# Altium schematic sheet NAVIGATION - MCU.SchDoc
size A2; SheetNumber: 6; SheetTotal: 7
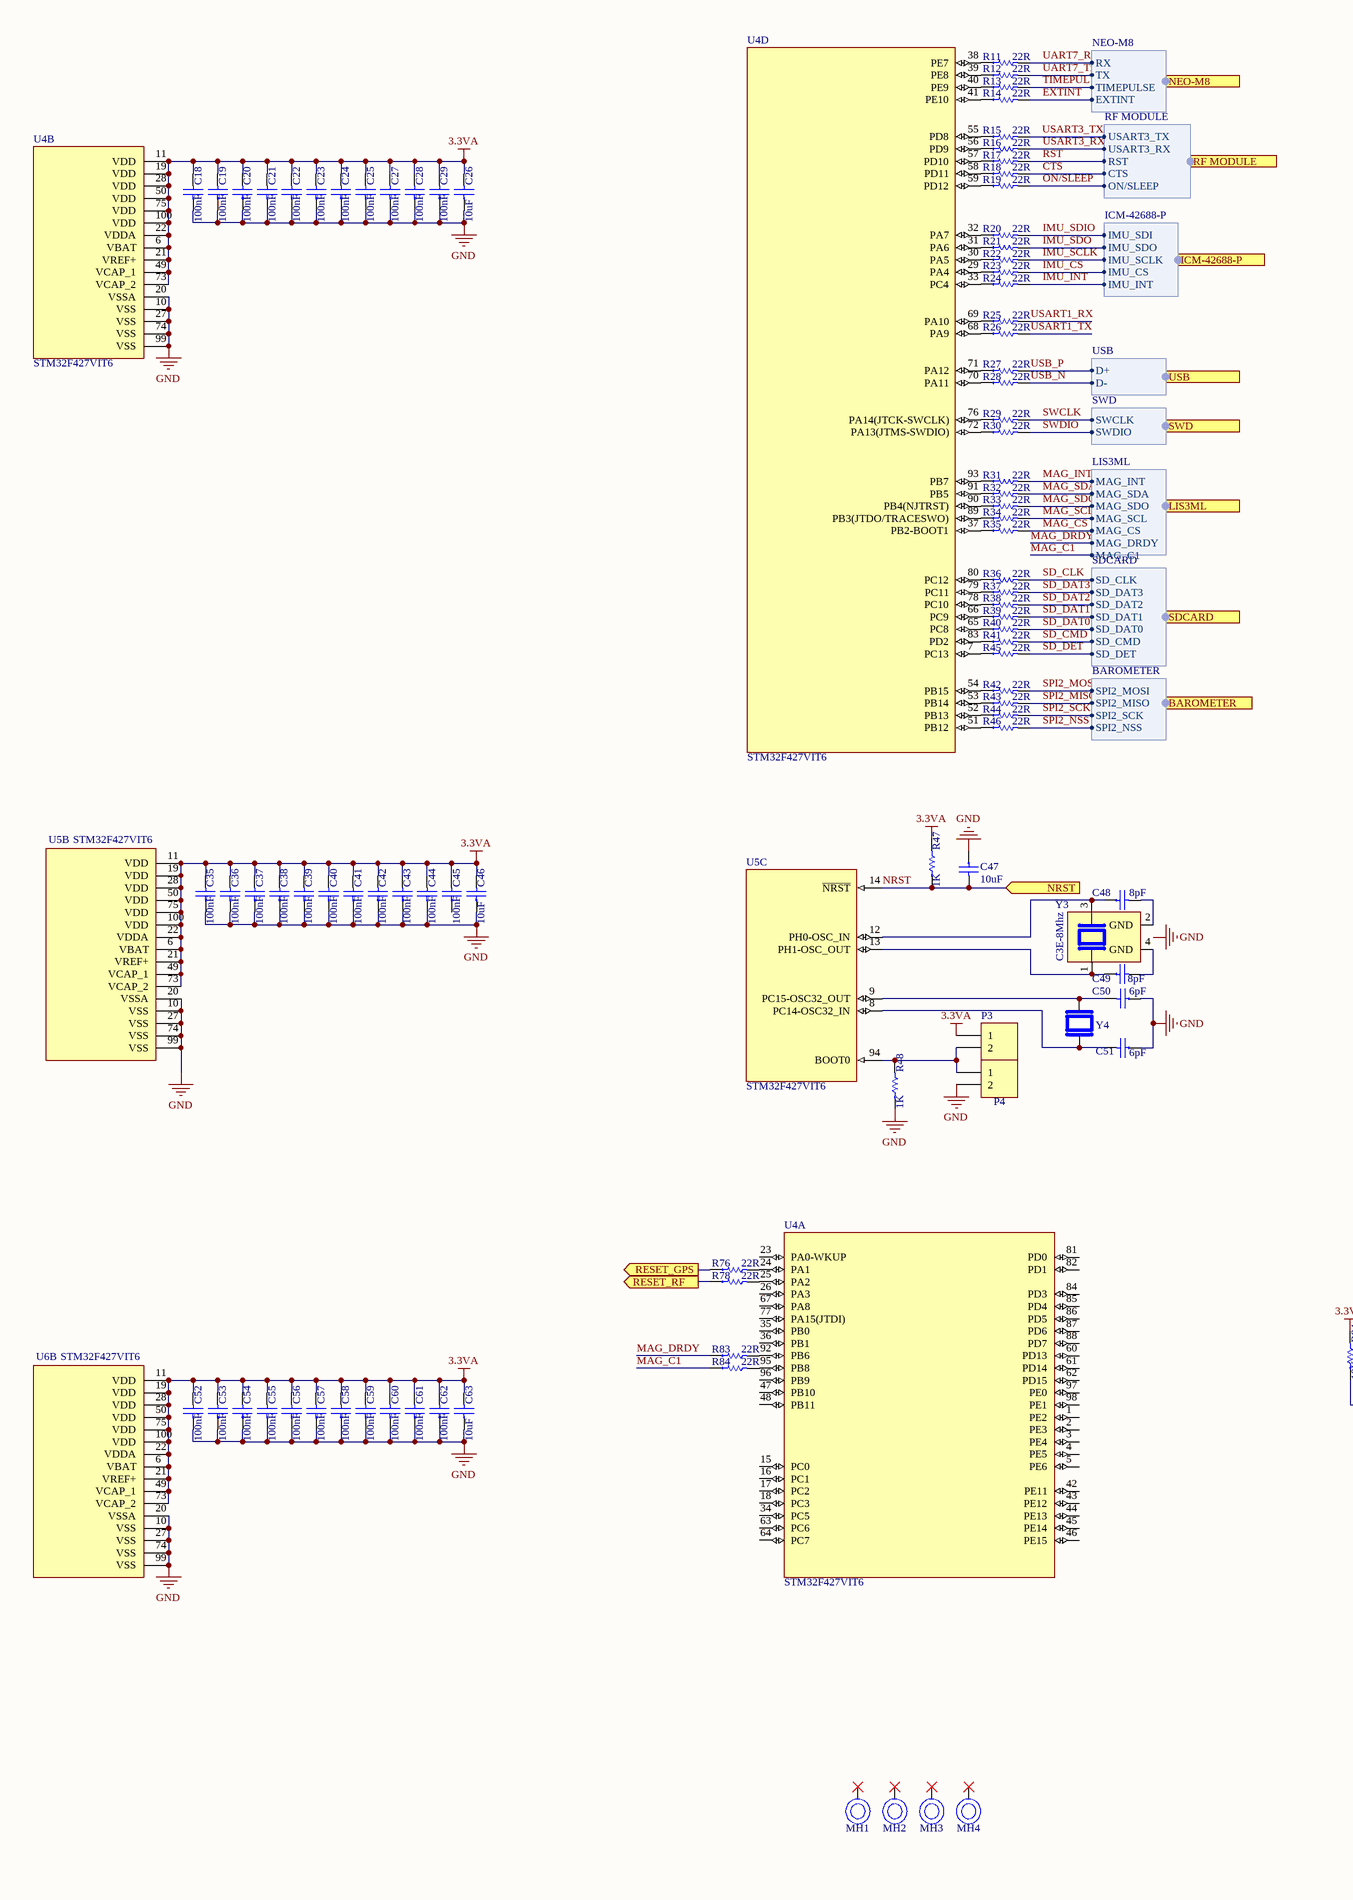
[diagram p0: NAVIGATION - MCU.SchDoc, left]
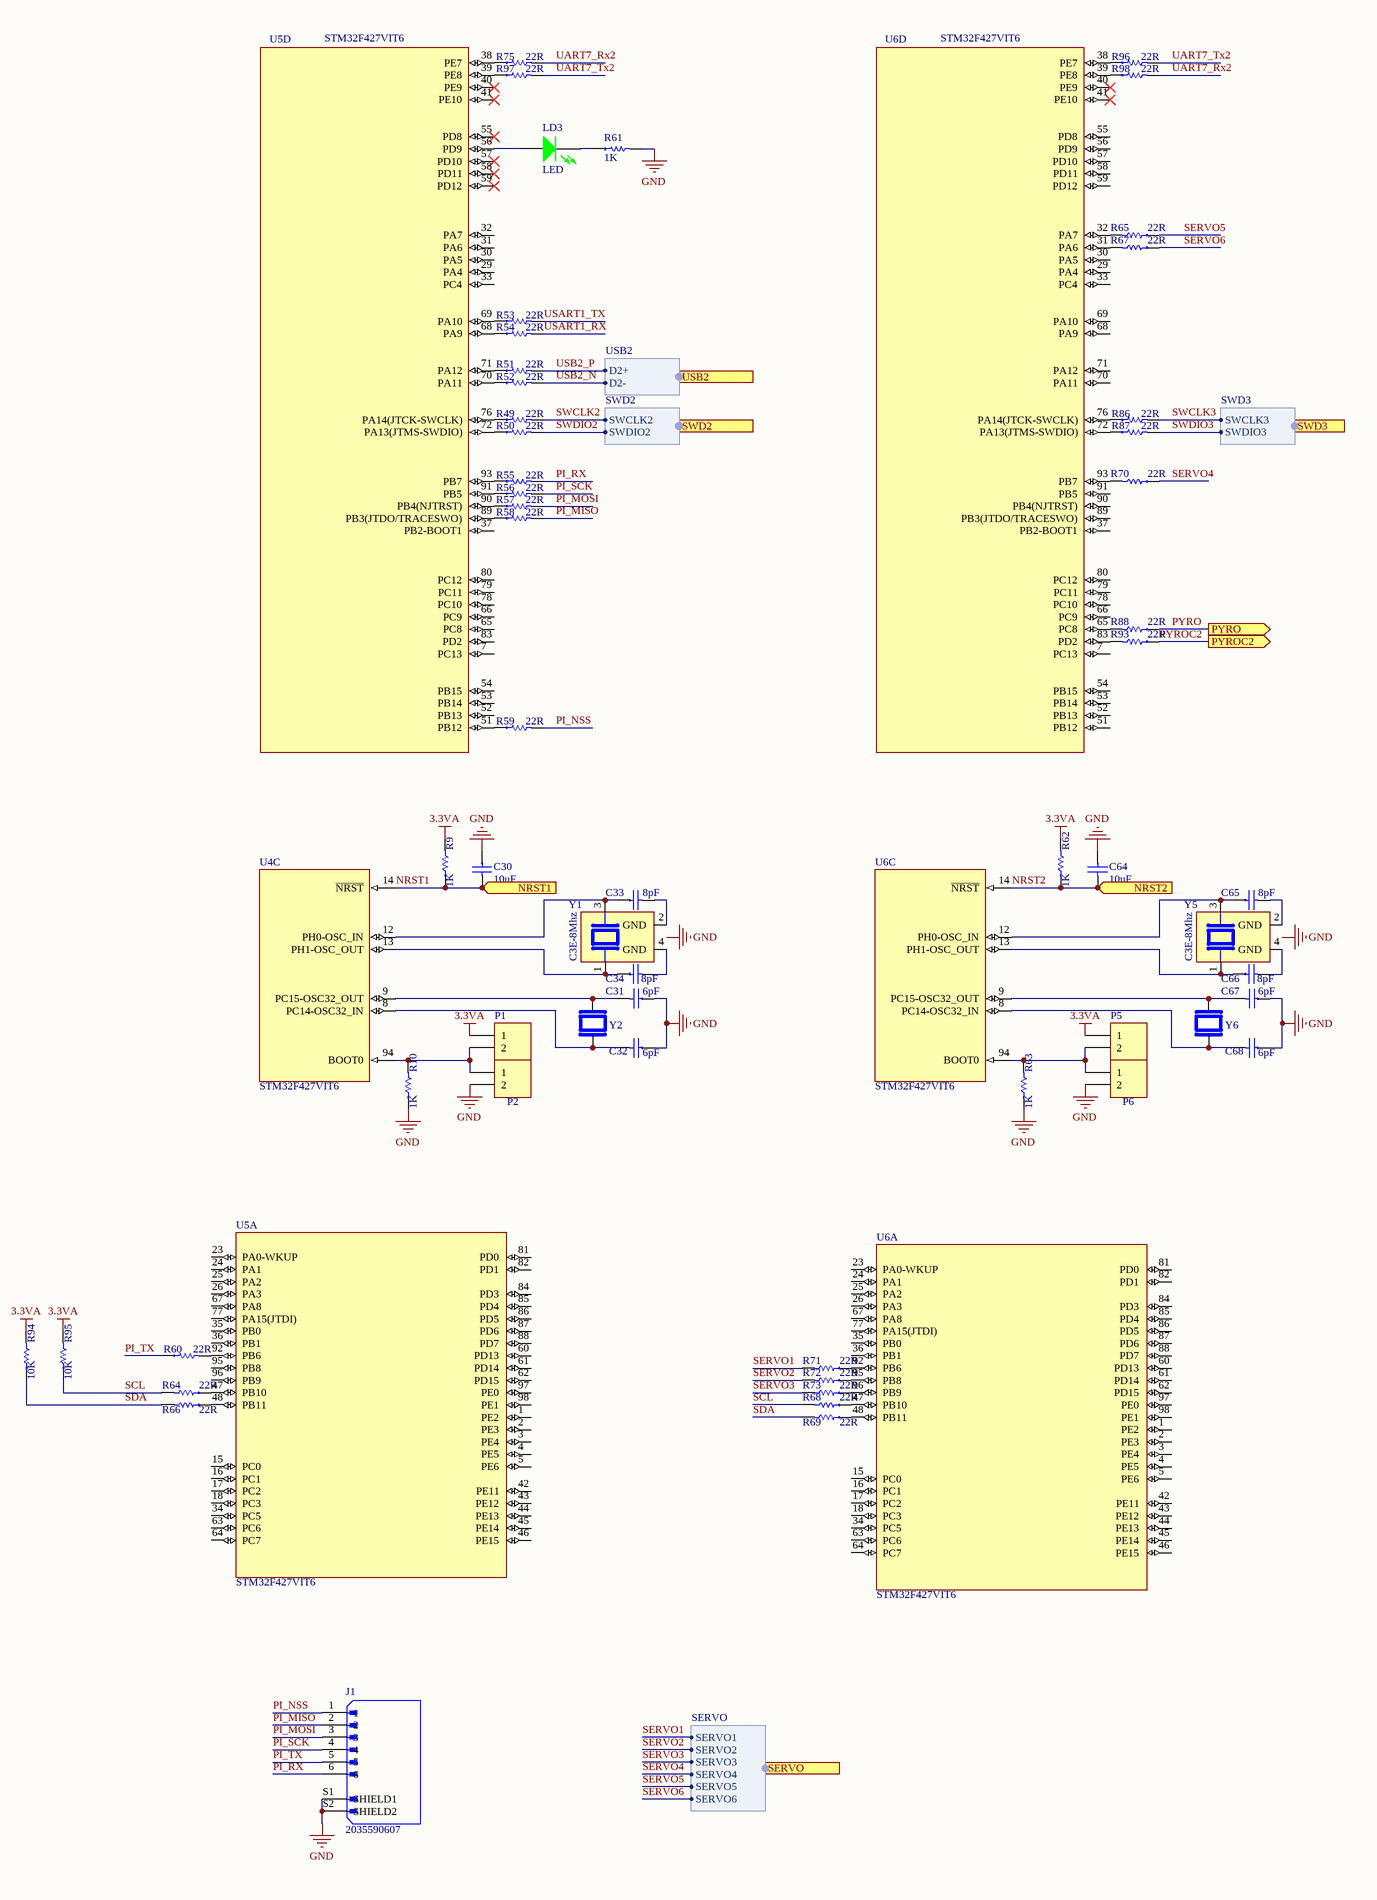
[diagram p1: NAVIGATION - MCU.SchDoc, right]

## Parts
C18  100nF  [CAP-CER0402-0.5H]
C19  100nF  [CAP-CER0402-0.5H]
C20  100nF  [CAP-CER0402-0.5H]
C21  100nF  [CAP-CER0402-0.5H]
C22  100nF  [CAP-CER0402-0.5H]
C23  100nF  [CAP-CER0402-0.5H]
C24  100nF  [CAP-CER0402-0.5H]
C25  100nF  [CAP-CER0402-0.5H]
C26  10uF  [CAP-CER0402-20mil]
C27  100nF  [CAP-CER0402-0.5H]
C28  100nF  [CAP-CER0402-0.5H]
C29  100nF  [CAP-CER0402-0.5H]
C30  10uF  [CAP-CER0402-20mil]
C31  6pF  [CAP-CER0402-0.5H]
C32  6pF  [CAP-CER0402-0.5H]
C33  8pF  [CAP-CER0402-0.5H]
C34  8pF  [CAP-CER0402-0.5H]
C35  100nF  [CAP-CER0402-0.5H]
C36  100nF  [CAP-CER0402-0.5H]
C37  100nF  [CAP-CER0402-0.5H]
C38  100nF  [CAP-CER0402-0.5H]
C39  100nF  [CAP-CER0402-0.5H]
C40  100nF  [CAP-CER0402-0.5H]
C41  100nF  [CAP-CER0402-0.5H]
C42  100nF  [CAP-CER0402-0.5H]
C43  100nF  [CAP-CER0402-0.5H]
C44  100nF  [CAP-CER0402-0.5H]
C45  100nF  [CAP-CER0402-0.5H]
C46  10uF  [CAP-CER0402-20mil]
C47  10uF  [CAP-CER0402-20mil]
C48  8pF  [CAP-CER0402-0.5H]
C49  8pF  [CAP-CER0402-0.5H]
C50  6pF  [CAP-CER0402-0.5H]
C51  6pF  [CAP-CER0402-0.5H]
C52  100nF  [CAP-CER0402-0.5H]
C53  100nF  [CAP-CER0402-0.5H]
C54  100nF  [CAP-CER0402-0.5H]
C55  100nF  [CAP-CER0402-0.5H]
C56  100nF  [CAP-CER0402-0.5H]
C57  100nF  [CAP-CER0402-0.5H]
C58  100nF  [CAP-CER0402-0.5H]
C59  100nF  [CAP-CER0402-0.5H]
C60  100nF  [CAP-CER0402-0.5H]
C61  100nF  [CAP-CER0402-0.5H]
C62  100nF  [CAP-CER0402-0.5H]
C63  10uF  [CAP-CER0402-20mil]
C64  10uF  [CAP-CER0402-20mil]
C65  8pF  [CAP-CER0402-0.5H]
C66  8pF  [CAP-CER0402-0.5H]
C67  6pF  [CAP-CER0402-0.5H]
C68  6pF  [CAP-CER0402-0.5H]
J1  2035590607  [MOLEX_2035590607]
LD3  LED  [LED-IND0402-GRE-0.4H]
MH1  MOUNTING HOLE  [M3]  (value not drawn)
MH2  MOUNTING HOLE  [M3]  (value not drawn)
MH3  MOUNTING HOLE  [M3]  (value not drawn)
MH4  MOUNTING HOLE  [M3]  (value not drawn)
P1  Header 2  [HDR1X2]  (value not drawn)
P2  Header 2  [HDR1X2]  (value not drawn)
P3  Header 2  [HDR1X2]  (value not drawn)
P4  Header 2  [HDR1X2]  (value not drawn)
P5  Header 2  [HDR1X2]  (value not drawn)
P6  Header 2  [HDR1X2]  (value not drawn)
R9  1K  [RES-CHP0402-0.35H]
R10  1K  [RES-CHP0402-0.35H]
R11  22R  [RES-CHP0402-0.35H]
R12  22R  [RES-CHP0402-0.35H]
R13  22R  [RES-CHP0402-0.35H]
R14  22R  [RES-CHP0402-0.35H]
R15  22R  [RES-CHP0402-0.35H]
R16  22R  [RES-CHP0402-0.35H]
R17  22R  [RES-CHP0402-0.35H]
R18  22R  [RES-CHP0402-0.35H]
R19  22R  [RES-CHP0402-0.35H]
R20  22R  [RES-CHP0402-0.35H]
R21  22R  [RES-CHP0402-0.35H]
R22  22R  [RES-CHP0402-0.35H]
R23  22R  [RES-CHP0402-0.35H]
R24  22R  [RES-CHP0402-0.35H]
R25  22R  [RES-CHP0402-0.35H]
R26  22R  [RES-CHP0402-0.35H]
R27  22R  [RES-CHP0402-0.35H]
R28  22R  [RES-CHP0402-0.35H]
R29  22R  [RES-CHP0402-0.35H]
R30  22R  [RES-CHP0402-0.35H]
R31  22R  [RES-CHP0402-0.35H]
R32  22R  [RES-CHP0402-0.35H]
R33  22R  [RES-CHP0402-0.35H]
R34  22R  [RES-CHP0402-0.35H]
R35  22R  [RES-CHP0402-0.35H]
R36  22R  [RES-CHP0402-0.35H]
R37  22R  [RES-CHP0402-0.35H]
R38  22R  [RES-CHP0402-0.35H]
R39  22R  [RES-CHP0402-0.35H]
R40  22R  [RES-CHP0402-0.35H]
R41  22R  [RES-CHP0402-0.35H]
R42  22R  [RES-CHP0402-0.35H]
R43  22R  [RES-CHP0402-0.35H]
R44  22R  [RES-CHP0402-0.35H]
R45  22R  [RES-CHP0402-0.35H]
R46  22R  [RES-CHP0402-0.35H]
R47  1K  [RES-CHP0402-0.35H]
R48  1K  [RES-CHP0402-0.35H]
R49  22R  [RES-CHP0402-0.35H]
R50  22R  [RES-CHP0402-0.35H]
R51  22R  [RES-CHP0402-0.35H]
R52  22R  [RES-CHP0402-0.35H]
R53  22R  [RES-CHP0402-0.35H]
R54  22R  [RES-CHP0402-0.35H]
R55  22R  [RES-CHP0402-0.35H]
R56  22R  [RES-CHP0402-0.35H]
R57  22R  [RES-CHP0402-0.35H]
R58  22R  [RES-CHP0402-0.35H]
R59  22R  [RES-CHP0402-0.35H]
R60  22R  [RES-CHP0402-0.35H]
R61  1K  [RES-CHP0402-0.35H]
R62  1K  [RES-CHP0402-0.35H]
R63  1K  [RES-CHP0402-0.35H]
R64  22R  [RES-CHP0402-0.35H]
R65  22R  [RES-CHP0402-0.35H]
R66  22R  [RES-CHP0402-0.35H]
R67  22R  [RES-CHP0402-0.35H]
R68  22R  [RES-CHP0402-0.35H]
R69  22R  [RES-CHP0402-0.35H]
R70  22R  [RES-CHP0402-0.35H]
R71  22R  [RES-CHP0402-0.35H]
R72  22R  [RES-CHP0402-0.35H]
R73  22R  [RES-CHP0402-0.35H]
R75  22R  [RES-CHP0402-0.35H]
R76  22R  [RES-CHP0402-0.35H]
R78  22R  [RES-CHP0402-0.35H]
R83  22R  [RES-CHP0402-0.35H]
R84  22R  [RES-CHP0402-0.35H]
R86  22R  [RES-CHP0402-0.35H]
R87  22R  [RES-CHP0402-0.35H]
R88  22R  [RES-CHP0402-0.35H]
R93  22R  [RES-CHP0402-0.35H]
R94  10K  [RES-CHP0402-0.35H]
R95  10K  [RES-CHP0402-0.35H]
R96  22R  [RES-CHP0402-0.35H]
R97  22R  [RES-CHP0402-0.35H]
R98  22R  [RES-CHP0402-0.35H]
U4  STM32F427VIT6  [QFP50P1600X1600X160-100N]  (parts A,B,C,D of 4)
U5  STM32F427VIT6  [QFP50P1600X1600X160-100N]  (parts A,B,C,D of 4)
U6  STM32F427VIT6  [QFP50P1600X1600X160-100N]  (parts A,B,C,D of 4)
Y1  C3E-8Mhz  [XTAL_C3E-8.000-8-1015-R]
Y2  ABS07-120-32.768KHZ-T  [XTAL_ABS07-120-32.768KHZ-T]  (value not drawn)
Y3  C3E-8Mhz  [XTAL_C3E-8.000-8-1015-R]
Y4  ABS07-120-32.768KHZ-T  [XTAL_ABS07-120-32.768KHZ-T]  (value not drawn)
Y5  C3E-8Mhz  [XTAL_C3E-8.000-8-1015-R]
Y6  ABS07-120-32.768KHZ-T  [XTAL_ABS07-120-32.768KHZ-T]  (value not drawn)

## Ports
BAROMETER (harness BAROMETER), ICM-42688-P (harness ICM-42688-P), LIS3ML (harness LIS3ML), NEO-M8 (harness NEO-M8), NRST1 (in), NRST2 (in), NRST (in), PYRO (out), PYROC2 (out), RESET_GPS (out), RESET_RF (out), RF MODULE (harness RF MODULE), SDCARD (harness SDCARD), SERVO (harness SERVO), SWD2 (harness SWD2), SWD3 (harness SWD3), SWD (harness SWD), USB2 (harness USB2), USB (harness USB)

## Harnesses
NEO-M8: RX, TX, TIMEPULSE, EXTINT
RF MODULE: USART3_TX, USART3_RX, RST, CTS, ON/SLEEP
ICM-42688-P: IMU_SDI, IMU_SDO, IMU_SCLK, IMU_CS, IMU_INT
USB: D-, D+
BAROMETER: SPI2_MOSI, SPI2_MISO, SPI2_SCK, SPI2_NSS
SDCARD: SD_CLK, SD_DAT3, SD_DAT2, SD_DAT1, SD_DAT0, SD_CMD, SD_DET
LIS3ML: MAG_INT, MAG_SDA, MAG_SDO, MAG_SCL, MAG_CS, MAG_DRDY, MAG_C1
SWD: SWDIO, SWCLK
USB2: D2-, D2+
SERVO: SERVO1, SERVO2, SERVO3, SERVO4, SERVO5, SERVO6
SWD2: SWDIO2, SWCLK2
SWD3: SWDIO3, SWCLK3

## Nets
3.3VA: C18.2 C19.2 C20.2 C21.2 C22.2 C23.2 C24.2 C25.2 C26.2 C27.2 C28.2 C29.2 C35.2 C36.2 C37.2 C38.2 C39.2 C40.2 C41.2 C42.2 C43.2 C44.2 C45.2 C46.2 C52.2 C53.2 C54.2 C55.2 C56.2 C57.2 C58.2 C59.2 C60.2 C61.2 C62.2 C63.2 P1.1 P3.1 P5.1 R9.2 R47.2 R62.2 R94.2 R95.2 U4.6(VBAT) U4.11(VDD) U4.19(VDD) U4.21(VREF+) U4.22(VDDA) U4.28(VDD) U4.49(VCAP_1) U4.50(VDD) U4.73(VCAP_2) U4.75(VDD) U4.100(VDD) U5.6(VBAT) U5.11(VDD) U5.19(VDD) U5.21(VREF+) U5.22(VDDA) U5.28(VDD) U5.49(VCAP_1) U5.50(VDD) U5.73(VCAP_2) U5.75(VDD) U5.100(VDD) U6.6(VBAT) U6.11(VDD) U6.19(VDD) U6.21(VREF+) U6.22(VDDA) U6.28(VDD) U6.49(VCAP_1) U6.50(VDD) U6.73(VCAP_2) U6.75(VDD) U6.100(VDD)
GND: C18.1 C19.1 C20.1 C21.1 C22.1 C23.1 C24.1 C25.1 C26.1 C27.1 C28.1 C29.1 C30.1 C31.1 C32.1 C35.1 C36.1 C37.1 C38.1 C39.1 C40.1 C41.1 C42.1 C43.1 C44.1 C46.1 C47.1 C50.1 C51.1 C52.1 C53.1 C54.1 C55.1 C56.1 C57.1 C58.1 C59.1 C60.1 C61.1 C62.1 C63.1 C64.1 C67.1 C68.1 J1.S1(SHIELD1) J1.S2(SHIELD2) P2.2 P4.2 P6.2 R10.1 R48.1 R61.2 R63.1 U4.10(VSS) U4.20(VSSA) U4.27(VSS) U4.74(VSS) U4.99(VSS) U5.10(VSS) U5.20(VSSA) U5.27(VSS) U5.74(VSS) U5.99(VSS) U6.10(VSS) U6.20(VSSA) U6.27(VSS) U6.74(VSS) U6.99(VSS)
CTS: R18.2 ; port RF MODULE.CTS
EXTINT: R14.2 ; port NEO-M8.EXTINT
IMU_CS: R23.2 ; port ICM-42688-P.IMU_CS
IMU_INT: R24.2 ; port ICM-42688-P.IMU_INT
IMU_SCLK: R22.2 ; port ICM-42688-P.IMU_SCLK
IMU_SDIO: R20.2 ; port ICM-42688-P.IMU_SDI
IMU_SDO: R21.2 ; port ICM-42688-P.IMU_SDO
MAG_C1: R84.1 ; port LIS3ML.MAG_C1
MAG_CS: R35.2 ; port LIS3ML.MAG_CS
MAG_DRDY: R83.1 ; port LIS3ML.MAG_DRDY
MAG_INT: R31.2 ; port LIS3ML.MAG_INT
MAG_SCL: R34.2 ; port LIS3ML.MAG_SCL
MAG_SDA: R32.2 ; port LIS3ML.MAG_SDA
MAG_SDO: R33.2 ; port LIS3ML.MAG_SDO
NRST: C47.2 R47.1 U5.14(~{NRST}) ; port NRST
NRST1: C30.2 R9.1 U4.14(~{NRST}) ; port NRST1
NRST2: C64.2 R62.1 U6.14(~{NRST}) ; port NRST2
ON/SLEEP: R19.2 ; port RF MODULE.ON/SLEEP
PI_MISO: J1.2 R58.2
PI_MOSI: J1.3 R57.2
PI_NSS: J1.1 R59.2
PI_RX: J1.6 R55.2
PI_SCK: J1.4 R56.2
PI_TX: J1.5 R60.1
PYRO: R88.1 ; port PYRO
PYROC2: R93.1 ; port PYROC2
RESET_GPS: R76.1 ; port RESET_GPS
RESET_RF: R78.1 ; port RESET_RF
RST: R17.2 ; port RF MODULE.RST
SCL: R64.2 R68.2 R95.1
SD_CLK: R36.2 ; port SDCARD.SD_CLK
SD_CMD: R41.2 ; port SDCARD.SD_CMD
SD_DAT0: R40.2 ; port SDCARD.SD_DAT0
SD_DAT1: R39.2 ; port SDCARD.SD_DAT1
SD_DAT2: R38.2 ; port SDCARD.SD_DAT2
SD_DAT3: R37.2 ; port SDCARD.SD_DAT3
SD_DET: R45.2 ; port SDCARD.SD_DET
SDA: R66.2 R69.2 R94.1
SERVO1: R71.2 ; port SERVO.SERVO1
SERVO2: R72.2 ; port SERVO.SERVO2
SERVO3: R73.2 ; port SERVO.SERVO3
SERVO4: R70.1 ; port SERVO.SERVO4
SERVO5: R65.1 ; port SERVO.SERVO5
SERVO6: R67.1 ; port SERVO.SERVO6
SPI2_MISO: R43.2 ; port BAROMETER.SPI2_MISO
SPI2_MOSI: R42.2 ; port BAROMETER.SPI2_MOSI
SPI2_NSS: R46.2 ; port BAROMETER.SPI2_NSS
SPI2_SCK: R44.2 ; port BAROMETER.SPI2_SCK
SWCLK: R29.2 ; port SWD.SWCLK
SWCLK2: R49.2 ; port SWD2.SWCLK2
SWCLK3: R86.2 ; port SWD3.SWCLK3
SWDIO: R30.2 ; port SWD.SWDIO
SWDIO2: R50.2 ; port SWD2.SWDIO2
SWDIO3: R87.2 ; port SWD3.SWDIO3
TIMEPUL: R13.2 ; port NEO-M8.TIMEPULSE
UART7_Rx: R11.2 ; port NEO-M8.RX
UART7_Rx2: R75.2 R98.2
UART7_Tx: R12.2 ; port NEO-M8.TX
UART7_Tx2: R96.2 R97.2
USART1_RX: R25.2 R54.2
USART1_TX: R26.2 R53.2
USART3_RX: R16.2 ; port RF MODULE.USART3_RX
USART3_TX: R15.2 ; port RF MODULE.USART3_TX
USB2_N: R52.2 ; port USB2.D2-
USB2_P: R51.2 ; port USB2.D2+
USB_N: R28.2 ; port USB.D-
USB_P: R27.2 ; port USB.D+
NetC31_2: C31.2 U4.9(PC15-OSC32_OUT) Y2.2
NetC32_2: C32.2 U4.8(PC14-OSC32_IN) Y2.1
NetC33_1: C33.1 U4.12(PH0-OSC_IN) Y1.3
NetC33_2: C33.2 Y1.2(GND)
NetC34_1: C34.1 U4.13(PH1-OSC_OUT) Y1.1
NetC34_2: C34.2 Y1.4(GND)
NetC48_1: C48.1 U5.12(PH0-OSC_IN) Y3.3
NetC48_2: C48.2 Y3.2(GND)
NetC49_1: C49.1 U5.13(PH1-OSC_OUT) Y3.1
NetC49_2: C49.2 Y3.4(GND)
NetC50_2: C50.2 U5.9(PC15-OSC32_OUT) Y4.2
NetC51_2: C51.2 U5.8(PC14-OSC32_IN) Y4.1
NetC65_1: C65.1 U6.12(PH0-OSC_IN) Y5.3
NetC65_2: C65.2 Y5.2(GND)
NetC66_1: C66.1 U6.13(PH1-OSC_OUT) Y5.1
NetC66_2: C66.2 Y5.4(GND)
NetC67_2: C67.2 U6.9(PC15-OSC32_OUT) Y6.2
NetC68_2: C68.2 U6.8(PC14-OSC32_IN) Y6.1
NetLD3_1: LD3.1(A) U5.56(PD9)
NetLD3_2: LD3.2(K) R61.1
NetP1_2: P1.2 P2.1 R10.2 U4.94(BOOT0)
NetP3_2: P3.2 P4.1 R48.2 U5.94(BOOT0)
NetP5_2: P5.2 P6.1 R63.2 U6.94(BOOT0)
NetR11_1: R11.1 U4.38(PE7)
NetR12_1: R12.1 U4.39(PE8)
NetR13_1: R13.1 U4.40(PE9)
NetR14_1: R14.1 U4.41(PE10)
NetR15_1: R15.1 U4.55(PD8)
NetR16_1: R16.1 U4.56(PD9)
NetR17_1: R17.1 U4.57(PD10)
NetR18_1: R18.1 U4.58(PD11)
NetR19_1: R19.1 U4.59(PD12)
NetR20_1: R20.1 U4.32(PA7)
NetR21_1: R21.1 U4.31(PA6)
NetR22_1: R22.1 U4.30(PA5)
NetR23_1: R23.1 U4.29(PA4)
NetR24_1: R24.1 U4.33(PC4)
NetR25_1: R25.1 U4.69(PA10)
NetR26_1: R26.1 U4.68(PA9)
NetR27_1: R27.1 U4.71(PA12)
NetR28_1: R28.1 U4.70(PA11)
NetR29_1: R29.1 U4.76(PA14(JTCK-SWCLK))
NetR30_1: R30.1 U4.72(PA13(JTMS-SWDIO))
NetR31_1: R31.1 U4.93(PB7)
NetR32_1: R32.1 U4.91(PB5)
NetR33_1: R33.1 U4.90(PB4(NJTRST))
NetR34_1: R34.1 U4.89(PB3(JTDO/TRACESWO))
NetR35_1: R35.1 U4.37(PB2-BOOT1)
NetR36_1: R36.1 U4.80(PC12)
NetR37_1: R37.1 U4.79(PC11)
NetR38_1: R38.1 U4.78(PC10)
NetR39_1: R39.1 U4.66(PC9)
NetR40_1: R40.1 U4.65(PC8)
NetR41_1: R41.1 U4.83(PD2)
NetR42_1: R42.1 U4.54(PB15)
NetR43_1: R43.1 U4.53(PB14)
NetR44_1: R44.1 U4.52(PB13)
NetR45_1: R45.1 U4.7(PC13)
NetR46_1: R46.1 U4.51(PB12)
NetR49_1: R49.1 U5.76(PA14(JTCK-SWCLK))
NetR50_1: R50.1 U5.72(PA13(JTMS-SWDIO))
NetR51_1: R51.1 U5.71(PA12)
NetR52_1: R52.1 U5.70(PA11)
NetR53_1: R53.1 U5.69(PA10)
NetR54_1: R54.1 U5.68(PA9)
NetR55_1: R55.1 U5.93(PB7)
NetR56_1: R56.1 U5.91(PB5)
NetR57_1: R57.1 U5.90(PB4(NJTRST))
NetR58_1: R58.1 U5.89(PB3(JTDO/TRACESWO))
NetR59_1: R59.1 U5.51(PB12)
NetR60_2: R60.2 U5.92(PB6)
NetR64_1: R64.1 U5.47(PB10)
NetR65_2: R65.2 U6.32(PA7)
NetR66_1: R66.1 U5.48(PB11)
NetR67_2: R67.2 U6.31(PA6)
NetR68_1: R68.1 U6.47(PB10)
NetR69_1: R69.1 U6.48(PB11)
NetR70_2: R70.2 U6.93(PB7)
NetR71_1: R71.1 U6.92(PB6)
NetR72_1: R72.1 U6.95(PB8)
NetR73_1: R73.1 U6.96(PB9)
NetR75_1: R75.1 U5.38(PE7)
NetR76_2: R76.2 U4.24(PA1)
NetR78_2: R78.2 U4.25(PA2)
NetR83_2: R83.2 U4.92(PB6)
NetR84_2: R84.2 U4.95(PB8)
NetR86_1: R86.1 U6.76(PA14(JTCK-SWCLK))
NetR87_1: R87.1 U6.72(PA13(JTMS-SWDIO))
NetR88_2: R88.2 U6.65(PC8)
NetR93_2: R93.2 U6.83(PD2)
NetR96_1: R96.1 U6.38(PE7)
NetR97_1: R97.1 U5.39(PE8)
NetR98_1: R98.1 U6.39(PE8)

Not connected (* = marked no-connect by the designer): C45 1; MH1 1(GND)*; MH2 1(GND)*; MH3 1(GND)*; MH4 1(GND)*; U4 1(PE2) 2(PE3) 3(PE4) 4(PE5) 5(PE6) 15(PC0) 16(PC1) 17(PC2) 18(PC3) 23(PA0-WKUP) 26(PA3) 34(PC5) 35(PB0) 36(PB1) 42(PE11) 43(PE12) 44(PE13) 45(PE14) 46(PE15) 47(PB10) 48(PB11) 60(PD13) 61(PD14) 62(PD15) 63(PC6) 64(PC7) 67(PA8) 77(PA15(JTDI)) 81(PD0) 82(PD1) 84(PD3) 85(PD4) 86(PD5) 87(PD6) 88(PD7) 96(PB9) 97(PE0) 98(PE1); U5 1(PE2) 2(PE3) 3(PE4) 4(PE5) 5(PE6) 7(PC13) 15(PC0) 16(PC1) 17(PC2) 18(PC3) 23(PA0-WKUP) 24(PA1) 25(PA2) 26(PA3) 29(PA4) 30(PA5) 31(PA6) 32(PA7) 33(PC4) 34(PC5) 35(PB0) 36(PB1) 37(PB2-BOOT1) 40(PE9)* 41(PE10)* 42(PE11) 43(PE12) 44(PE13) 45(PE14) 46(PE15) 52(PB13) 53(PB14) 54(PB15) 55(PD8)* 57(PD10)* 58(PD11)* 59(PD12)* 60(PD13) 61(PD14) 62(PD15) 63(PC6) 64(PC7) 65(PC8) 66(PC9) 67(PA8) 77(PA15(JTDI)) 78(PC10) 79(PC11) 80(PC12) 81(PD0) 82(PD1) 83(PD2) 84(PD3) 85(PD4) 86(PD5) 87(PD6) 88(PD7) 95(PB8) 96(PB9) 97(PE0) 98(PE1); U6 1(PE2) 2(PE3) 3(PE4) 4(PE5) 5(PE6) 7(PC13) 15(PC0) 16(PC1) 17(PC2) 18(PC3) 23(PA0-WKUP) 24(PA1) 25(PA2) 26(PA3) 29(PA4) 30(PA5) 33(PC4) 34(PC5) 35(PB0) 36(PB1) 37(PB2-BOOT1) 40(PE9)* 41(PE10)* 42(PE11) 43(PE12) 44(PE13) 45(PE14) 46(PE15) 51(PB12) 52(PB13) 53(PB14) 54(PB15) 55(PD8) 56(PD9) 57(PD10) 58(PD11) 59(PD12) 60(PD13) 61(PD14) 62(PD15) 63(PC6) 64(PC7) 66(PC9) 67(PA8) 68(PA9) 69(PA10) 70(PA11) 71(PA12) 77(PA15(JTDI)) 78(PC10) 79(PC11) 80(PC12) 81(PD0) 82(PD1) 84(PD3) 85(PD4) 86(PD5) 87(PD6) 88(PD7) 89(PB3(JTDO/TRACESWO)) 90(PB4(NJTRST)) 91(PB5) 97(PE0) 98(PE1)

## Notes on the sheet
- Labels drawn without touching a wire or pin: GND

## Library data of the parts
C18-C25 C27-C29 C31-C45 C48-C62 C65-C68 = CAPCER0013 100nF 10% 50V X7R 0402 SMD: CAP CER 100nF 10% 50V X7R 0402 SMD; LINE: SMT; TYPE: EP; UNIT: PCS; TMG CODE: None; CERTIFICATION: NA; CLASS: B; MOUNT: SMD; TMG PN: CAPCER0013; ComponentLink1Description: Datasheet; ComponentLink1URL: https://datasheet.lcsc.com/lcsc/1811021431_Samsung-Electro-Mechanics-CL10B104KB8NNNC_C1591.pdf; Footprint: 0402
C26 C30 C46 C47 C63 C64 = CAPCER0040 10uF 20% 6.3V X5R 0402 SMD: CAP CER 10uF 20% 6.3V X5R 0402 SMD; LINE: SMT; TYPE: EP; UNIT: PCS; TMG PN: CAPCER0013; TMG CODE: None; CERTIFICATION: NA; CLASS: B; MOUNT: SMD; ComponentLink1Description: Datasheet; ComponentLink1URL: https://datasheet.lcsc.com/lcsc/2304140030_YAGEO-CC0402MRX5R5BB106_C105884.pdf; Footprint: 0402
LD3 = LEDIND0005 GRE CLR 2.4V 20mA 0402 SMD: LED IND GRE CLR 2.4V 20mA 0402 SMD; LINE: SMT; TYPE: EP; UNIT: PCS; TMG CODE: None; CERTIFICATION: NA; CLASS: B; MOUNT: SMD; ComponentLink1Description: Datasheet; ComponentLink1URL: https://datasheet.lcsc.com/lcsc/2102221739_Yongyu-Photoelectric-SZYY0402YG_C434449.pdf
MH1-MH4 = MH
P1-P6 = Header 2: Header, 2-Pin; LatestRevisionDate: 17-Jul-2002; LatestRevisionNote: Re-released for DXP Platform.; Publisher: Altium Limited
R9-R73 R75 R76 R78 R83 R84 R86-R88 R93-R98 = RESCHP0097 100K 1% 0402 SMD: RES CHP 100K 1% 1/16W 0402 SMD; LINE: SMT; UNIT: PCS; TMG CODE: None; CERTIFICATION: NA; CLASS: B; MOUNT: SMD; TYPE: EP; ComponentLink1Description: Datasheet; ComponentLink1URL: https://datasheet.lcsc.com/lcsc/2304140030_YAGEO-AC0402FR-0710KL_C144807.pdf
U4-U6 = STM32F427VIT6: ARMÂ® CortexÂ®-M4 STM32F4 Microcontroller IC 32-Bit Single-Core 180MHz 2MB (2M x 8) FLASH 100-LQFP (14x14); MF: STMicroelectronics; SnapEDA_Link: https://www.snapeda.com/parts/STM32F427VIT6/STMicroelectronics/view-part/?ref=snap; Package: LQFP-100 STMicroelectronics; Value: *; MP: STM32F427VIT6; Check_prices: https://www.snapeda.com/parts/STM32F427VIT6/STMicroelectronics/view-part/?ref=eda
Y1 Y3 Y5 = C3E-8.000-8-1015-R: Package: None; Price: None; Value: *; MP: C3E-8.000-8-1015-R; Availability: Unavailable
Y2 Y4 Y6 = ABS07-120-32.768KHZ-T: 32.768 kHz Â±20ppm Crystal 6pF 55 kOhms 2-SMD, No Lead; MF: Abracon; Package: SMD-2 Abracon LLC; Purchase-URL: https://pricing.snapeda.com/search/part/ABS07-120-32.768KHZ-T/?ref=eda; Value: *; Digi-Key_Part_Number: 535-11937-2-ND; SnapEDA_Link: https://www.snapeda.com/parts/ABS07-120-32.768KHZ-T/Abracon+LLC/view-part/?ref=snap; MP: ABS07-120-32.768KHZ-T; Check_prices: https://www.snapeda.com/parts/ABS07-120-32.768KHZ-T/Abracon+LLC/view-part/?ref=eda
J1 = 2035590607: Package: None; Availability: Unavailable; Price: None; MP: 2035590607; Value: *